# EAGLE design MegaSolardexEnergy (EAGLE 9.1.1)
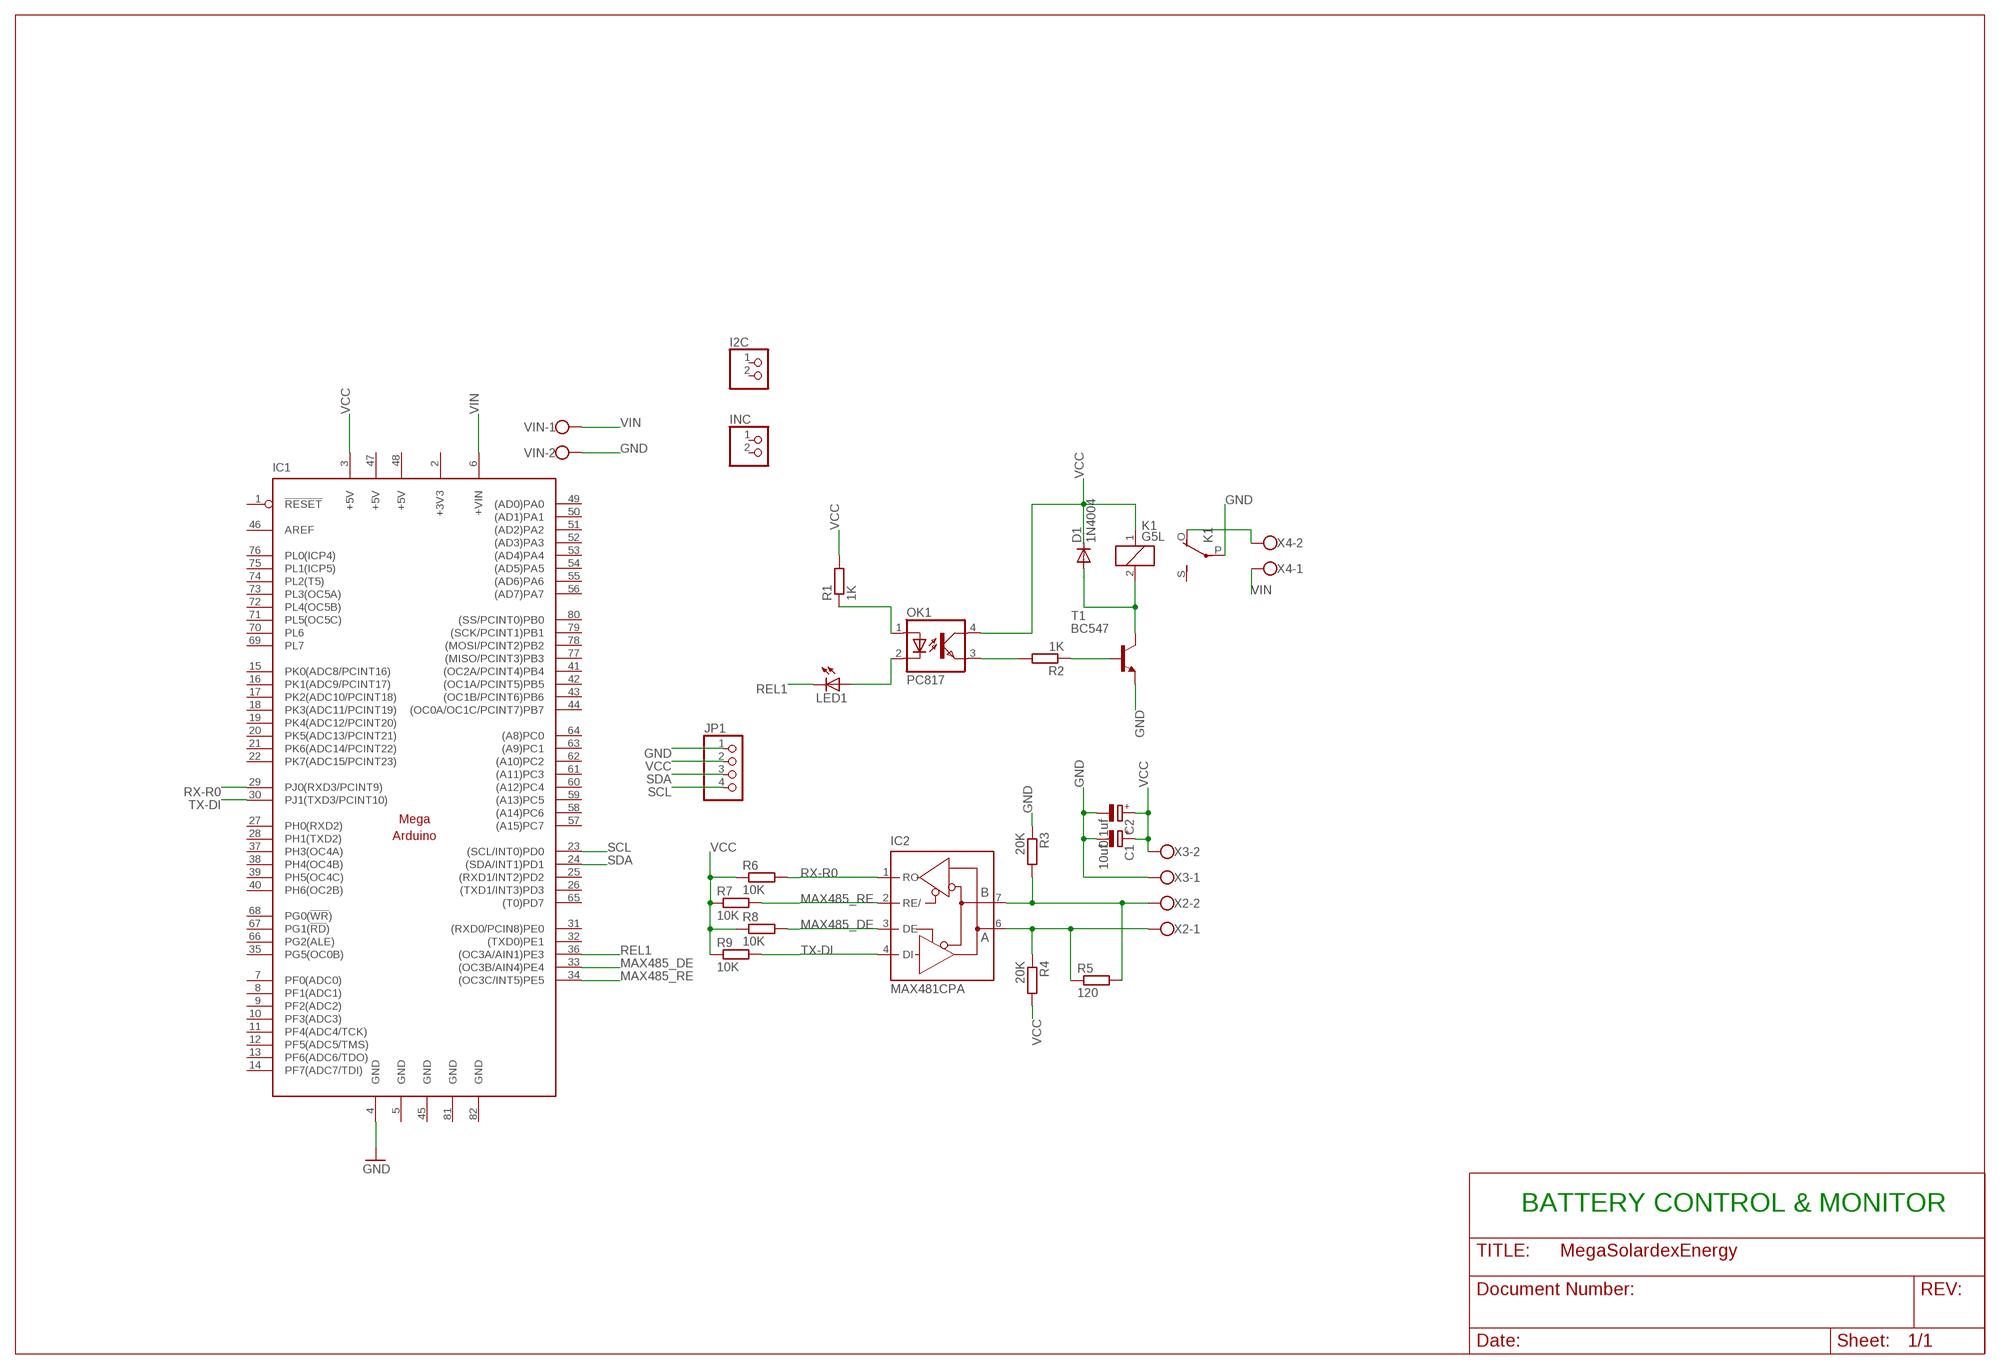
[diagram p0: schematic, sheet 1]

## Parts
C1  10uf  CPOL-EUE2,5-6E  [E2,5-6E]
C2  0,1uf  CPOL-EUE2,5-6E  [E2,5-6E]
D1  1N4004  [DO41-10]
I2C  PINHD-1X2  [1X02]
IC1  MEGAARDUINO_1  [MEGA_ARDUINO]
IC2  MAX481CPA  [DIL08]
INC  PINHD-1X2  [1X02]
JP1  PINHD-1X4  [1X04]
K1  G5L  [G5LE]
LED1  LED5MM  [LED5MM]
OK1  PC817  [DIL04]
R1  1K  R-EU_0204/7  [0204/7]
R2  1K  R-EU_0204/7  [0204/7]
R3  20K  R-EU_0204/7  [0204/7]
R4  20K  R-EU_0204/7  [0204/7]
R5  120  R-EU_0204/7  [0204/7]
R6  10K  R-EU_0204/7  [0204/7]
R7  10K  R-EU_0204/7  [0204/7]
R8  10K  R-EU_0204/7  [0204/7]
R9  10K  R-EU_0204/7  [0204/7]
T1  BC547  [TO92]
VIN  W237-102  [W237-102]
X2  W237-102  [W237-102]
X3  W237-102  [W237-102]
X4  W237-102  [W237-102]

## Nets
GND: C1.- C2.- IC1.4(GND) JP1.1 K1.P(2:P) R3.1 T1.1(E) VIN.2 X3.1
MAX485_DE: IC1.33((OC3B/AIN4)PE4) IC2.3(DE) R8.2
MAX485_RE: IC1.34((OC3C/INT5)PE5) IC2.2(RE/) R7.2
N$1: OK1.1(A) R1.1
N$2: LED1.A OK1.2(C)
N$3: OK1.3(EMIT) R2.2
N$4: R2.1 T1.2(B)
N$5: D1.A K1.2 T1.3(C)
N$6: K1.O(2:O) X4.2
N$9: IC2.7(B) R3.2 R5.2 X2.2
N$10: IC2.6(A) R4.1 R5.1 X2.1
REL1: IC1.36((OC3A/AIN1)PE3) LED1.K(C)
RX-R0: IC1.29(PJ0(RXD3/PCINT9)) IC2.1(RO) R6.2
SCL: IC1.23((SCL/INT0)PD0) JP1.4
SDA: IC1.24((SDA/INT1)PD1) JP1.3
TX-DI: IC1.30(PJ1(TXD3/PCINT10)) IC2.4(DI) R9.2
VCC: C1.+ C2.+ D1.C IC1.3(+5V) JP1.2 K1.1 OK1.4(COL) R1.2 R4.2 R6.1 R7.1 R8.1 R9.1 X3.2
VIN: IC1.6(+VIN) VIN.1 X4.1
Unconnected: I2C.1 I2C.2 IC1.1(!RESET) IC1.7(PF0(ADC0)) IC1.8(PF1(ADC1)) IC1.9(PF2(ADC2)) IC1.10(PF3(ADC3)) IC1.11(PF4(ADC4/TCK)) IC1.12(PF5(ADC5/TMS)) IC1.13(PF6(ADC6/TDO)) IC1.14(PF7(ADC7/TDI)) IC1.15(PK0(ADC8/PCINT16)) IC1.16(PK1(ADC9/PCINT17)) IC1.17(PK2(ADC10/PCINT18)) IC1.18(PK3(ADC11/PCINT19)) IC1.19(PK4(ADC12/PCINT20)) IC1.20(PK5(ADC13/PCINT21)) IC1.21(PK6(ADC14/PCINT22)) IC1.22(PK7(ADC15/PCINT23)) IC1.25((RXD1/INT2)PD2) IC1.26((TXD1/INT3)PD3) IC1.27(PH0(RXD2)) IC1.28(PH1(TXD2)) IC1.31((RXD0/PCIN8)PE0) IC1.32((TXD0)PE1) IC1.35(PG5(OC0B)) IC1.37(PH3(OC4A)) IC1.38(PH4(OC4B)) IC1.39(PH5(OC4C)) IC1.40(PH6(OC2B)) IC1.41((OC2A/PCINT4)PB4) IC1.42((OC1A/PCINT5)PB5) IC1.43((OC1B/PCINT6)PB6) IC1.44((OC0A/OC1C/PCINT7)PB7) IC1.46(AREF) IC1.49((AD0)PA0) IC1.50((AD1)PA1) IC1.51((AD2)PA2) IC1.52((AD3)PA3) IC1.53((AD4)PA4) IC1.54((AD5)PA5) IC1.55((AD6)PA6) IC1.56((AD7)PA7) IC1.57((A15)PC7) IC1.58((A14)PC6) IC1.59((A13)PC5) IC1.60((A12)PC4) IC1.61((A11)PC3) IC1.62((A10)PC2) IC1.63((A9)PC1) IC1.64((A8)PC0) IC1.65((T0)PD7) IC1.66(PG2(ALE)) IC1.67(PG1(!RD!)) IC1.68(PG0(!WR!)) IC1.69(PL7) IC1.70(PL6) IC1.71(PL5(OC5C)) IC1.72(PL4(OC5B)) IC1.73(PL3(OC5A)) IC1.74(PL2(T5)) IC1.75(PL1(ICP5)) IC1.76(PL0(ICP4)) IC1.77((MISO/PCINT3)PB3) IC1.78((MOSI/PCINT2)PB2) IC1.79((SCK/PCINT1)PB1) IC1.80((SS/PCINT0)PB0) INC.1 INC.2 K1.S(2:S)

## Notes on the sheet
- BATTERY CONTROL & MONITOR

## Power pins joined to a net without a drawn wire
+3V3: IC1.2(+3V3)
+5V: IC1.47(+5V) IC1.48(+5V)
GND: IC1.5(GND) IC1.45(GND) IC1.81(GND) IC1.82(GND) IC2.5(GND)
VCC: IC2.8(VCC)

## Library data of the parts
C1 C2 = rcl:CPOL-EU: POLARIZED CAPACITOR, European symbol; SPICEPREFIX: C
D1 = diode:1N4004: DIODE general purpose rectifier, 1 A
I2C INC = pinhead:PINHD-1X2: PIN HEADER
IC1 = arduino:MEGAARDUINO_1: The Arduino Mega is a microcontroller board based on the ATmega1280. - 54 digital input/output pins (of which 14 can be used as PWM outputs) - 16 analog inputs - 4 UARTs (hardware serial ports) - 16 MHz crystal oscillator - USB connection - power jack - ICSP header - reset button It contains everything needed to support the microcontroller; simply connect it to a computer with a USB cable or power it with a AC-to-DC adapter or battery to get started. The Mega is compatible with most shields designed for the Arduino Duemilanove or Diecimila. http://arduino.cc/en/Main/ArduinoBoardMega
IC2 = maxim:MAX481CPA: RS485 TRANSEIVER; MPN: MAX481CPA+; OC_FARNELL: unknown; OC_NEWARK: 99K3445
JP1 = pinhead:PINHD-1X4: PIN HEADER
K1 = relay:G5L: RELAY 1 x switch, 10 A/120 V AC, 8 A/30 V ADC, Omron; OC_FARNELL: unknown; OC_NEWARK: unknown
LED1 = led:LED: LED OSRAM: - CHIPLED LG R971, LG N971, LY N971, LG Q971, LY Q971, LO R971, LY R971 LH N974, LH R974 LS Q976, LO Q976, LY Q976 LO Q996 - Hyper CHIPLED LW Q18S LB Q993, LB Q99A, LB R99A - SideLED LS A670, LO A670, LY A670, LG A670, LP A670 LB A673, LV A673, LT A673, LW A673 LH A674 LY A675 LS A676, LA A676, LO A676, LY A676, LW A676 LS A679, LY A679, LG A679 - Hyper Micro SIDELED® LS Y876, LA Y876, LO Y876, LY Y876 LT Y87S - SmartLED LW L88C, LW L88S LB L89C, LB L89S, LG L890 LS L89K, LO L89K, LY L89K LS L896, LA L896, LO L896, LY L896 - TOPLED LS T670, LO T670, LY T670, LG T670, LP T670 LSG T670, LSP T670, LSY T670, LOP T670, LYG T670 LG T671, LOG T671, LSG T671 LB T673, LV T673, LT T673, LW T673 LH T674 LS T676, LA T676, LO T676, LY T676, LB T676, LH T676, LSB T676, LW T676 LB T67C, LV T67C, LT T67C, LS T67K, LO T67K, LY T67K, LW E67C LS E67B, LA E67B, LO E67B, LY E67B, LB E67C, LV E67C, LT E67C LW T67C LS T679, LY T679, LG T679 LS T770, LO T770, LY T770, LG T770, LP T770 LB T773, LV T773, LT T773, LW T773 LH T774 LS E675, LA E675, LY E675, LS T675 LS T776, LA T776, LO T776, LY T776, LB T776 LHGB T686 LT T68C, LB T68C - Hyper Mini TOPLED® LB M676 - Mini TOPLED Santana® LG M470 LS M47K, LO M47K, LY M47K Source: http://www.osram.convergy.de LUXEON: - LUMILED® LXK2-PW12-R00, LXK2-PW12-S00, LXK2-PW14-U00, LXK2-PW14-V00 LXK2-PM12-R00, LXK2-PM12-S00, LXK2-PM14-U00 LXK2-PE12-Q00, LXK2-PE12-R00, LXK2-PE12-S00, LXK2-PE14-T00, LXK2-PE14-U00 LXK2-PB12-K00, LXK2-PB12-L00, LXK2-PB12-M00, LXK2-PB14-N00, LXK2-PB14-P00, LXK2-PB14-Q00 LXK2-PR12-L00, LXK2-PR12-M00, LXK2-PR14-Q00, LXK2-PR14-R00 LXK2-PD12-Q00, LXK2-PD12-R00, LXK2-PD12-S00 LXK2-PH12-R00, LXK2-PH12-S00 LXK2-PL12-P00, LXK2-PL12-Q00, LXK2-PL12-R00 Source: www.luxeon.com KINGBRIGHT: KA-3528ASYC Source: www.kingbright.com
OK1 = optocoupler:PC817: SHARP OPTO COUPLER; MPN: PC817X4J000F; OC_FARNELL: 9707727; OC_NEWARK: 97K7059
R1-R9 = rcl:R-EU_: RESISTOR, European symbol; SPICEPREFIX: R
T1 = transistor-neu-to92:BC547: NPN TRANSISTOR
VIN X2-X4 = con-wago-500:W237-102: WAGO SCREW CLAMP; MPN: 237-102; OC_FARNELL: unknown; OC_NEWARK: 70K9898

## Board
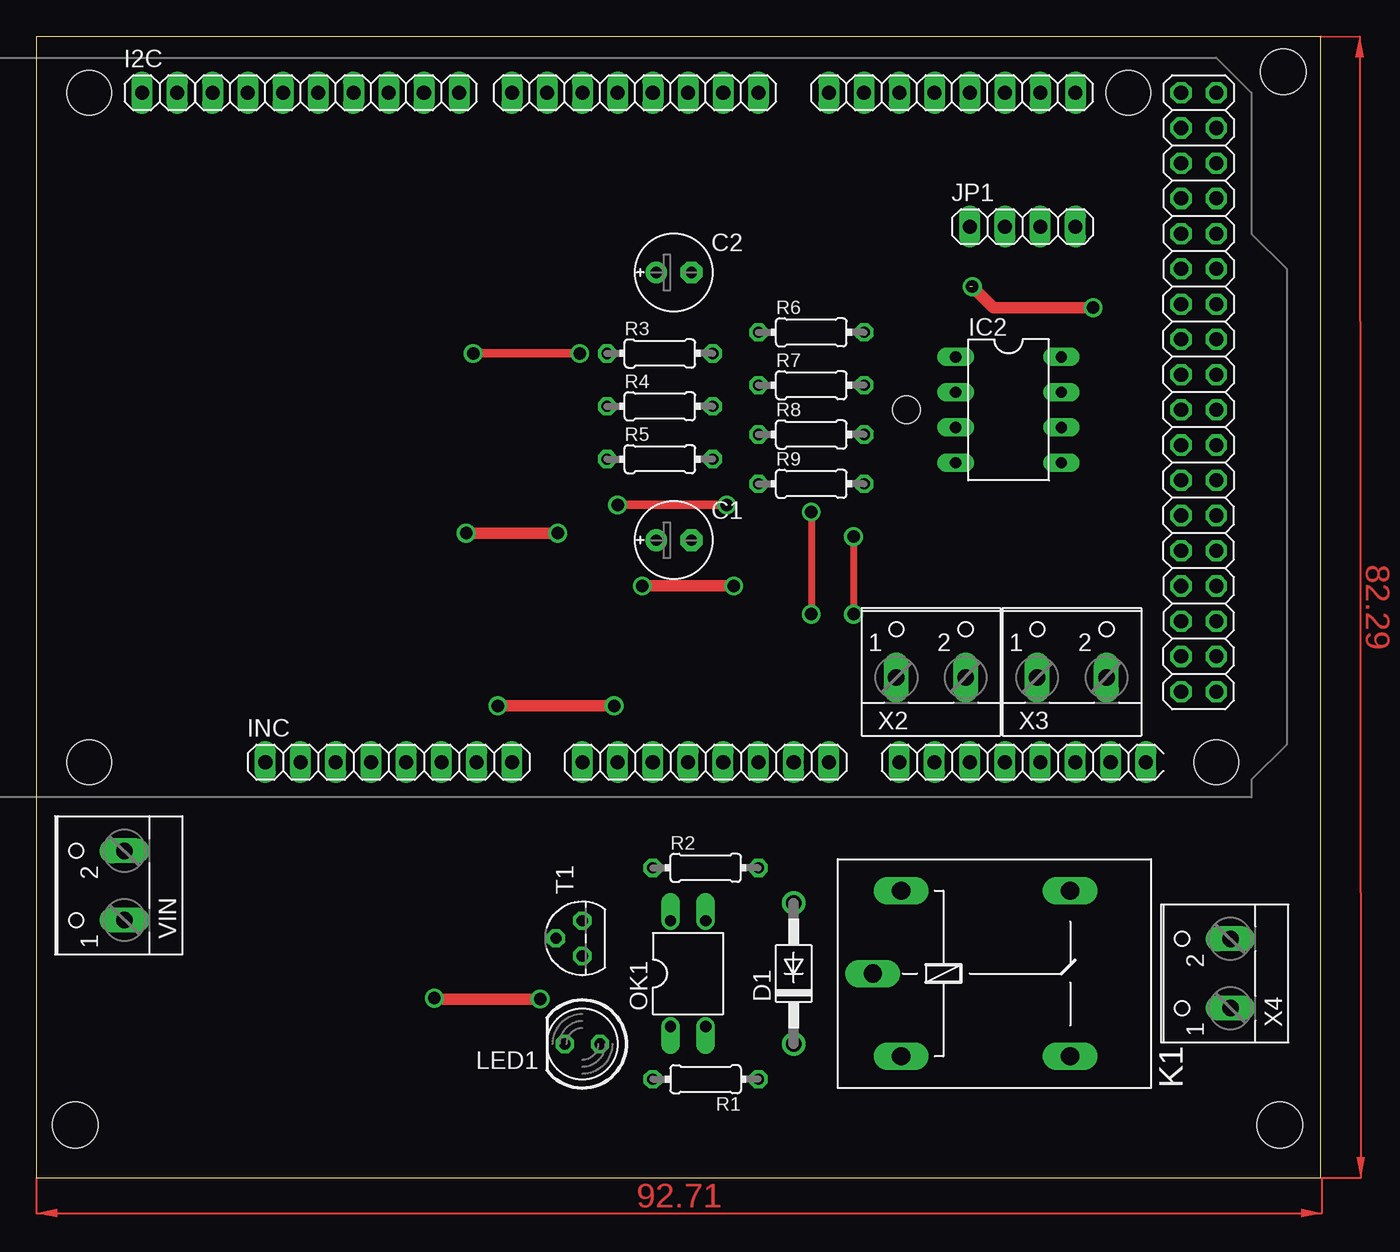
[diagram p1: board, top side]
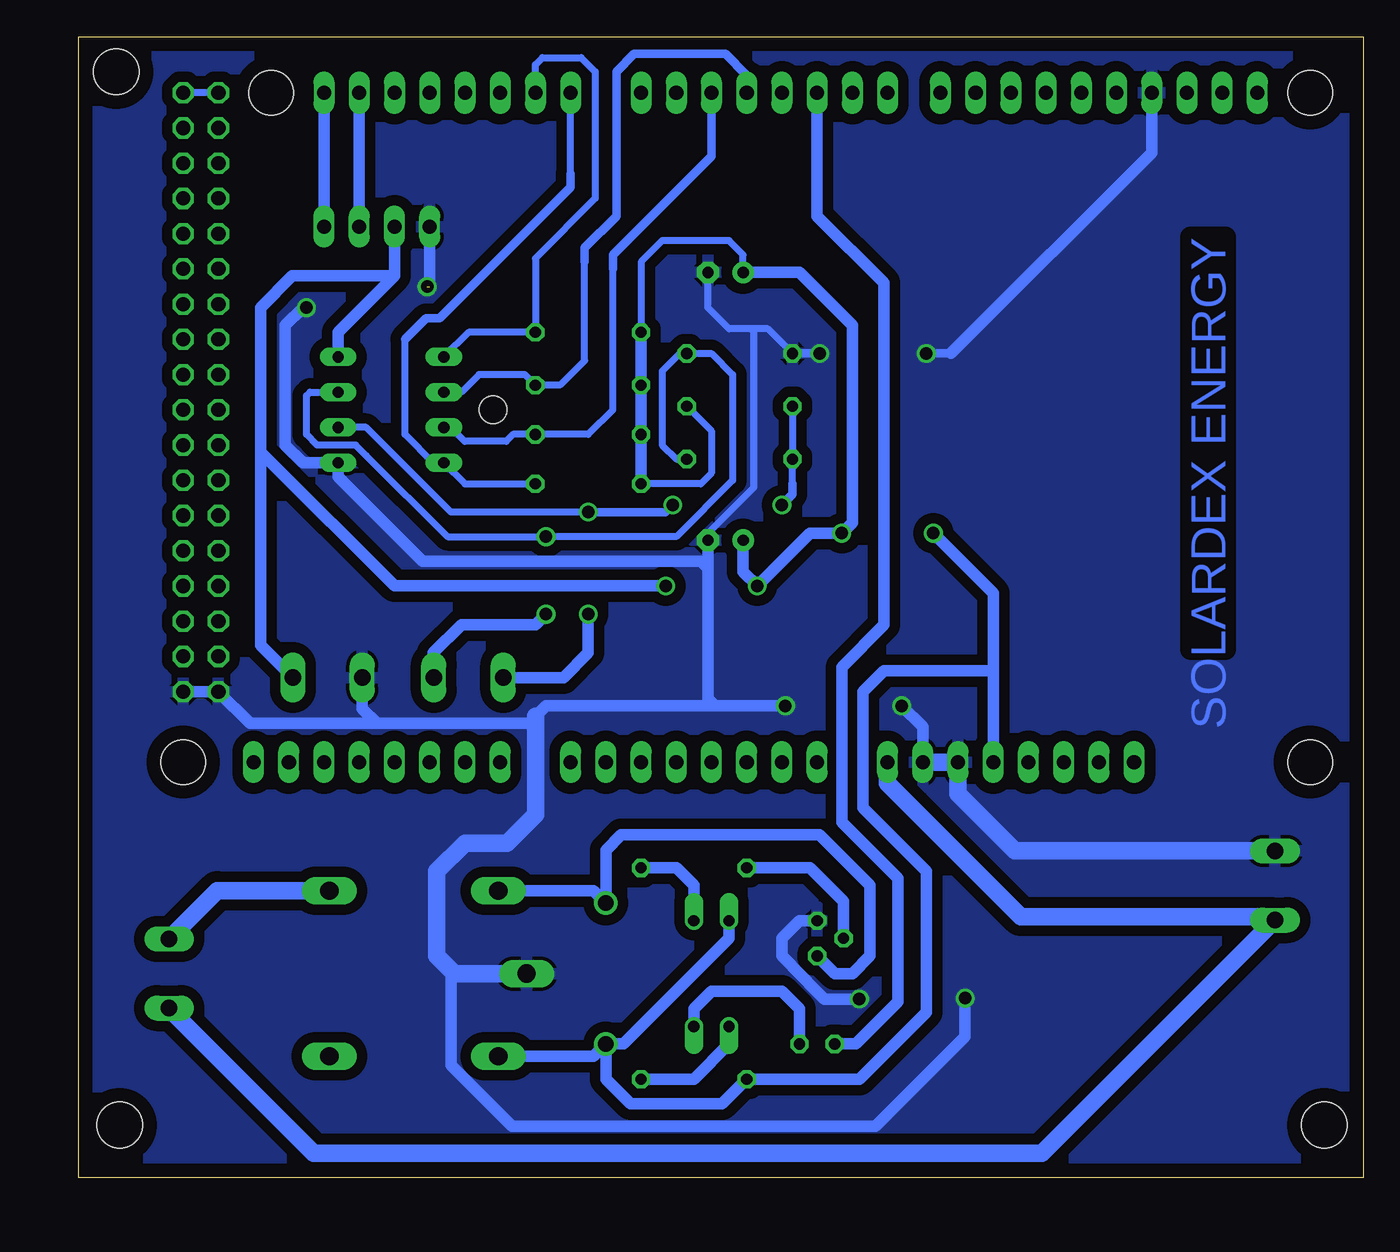
[diagram p2: board, bottom side, seen from below]

Size 92.63 x 82.29 mm. Coordinates in mm from the lower left corner, seen from the top.
Outline: 0,0 92.63,0 92.63,82.29 0,82.29 0,0
Copper layers (1*16): Top 0.035mm / dielectric 1.5mm / Bottom 0.035mm
Design rules "default *": minimum track width 6mil, minimum drill 0.35mm, track to track 30mil, track to pad 30mil, pad to pad 30mil, via to via 30mil, smd to smd 30mil, copper to edge 40mil, drill to drill 6mil, minimum pad ring 10mil, minimum via ring 8mil, stop-mask expansion 4mil, vias tented up to drill 0mil, thermal gap 10mil
Holes 3.3 mm at 89.92,79.76 89.66,3.81 2.79,3.81

### Footprints (pad centres in the part's own frame; a part is rotated, then mirrored left to right if it is on the bottom)
E2,5-6E = drill 0.813 pad 1.575: + -1.27,0 | drill 0.813 pad 1.575 octagon: - 1.27,0
DO41-10 = drill 1.118: A 5.08,0; C -5.08,0
1X02 = drill 1.016 long: 1 -1.27,0; 2 1.27,0
MEGA_ARDUINO = drill 1.016 long: 1 33.02,2.54; 2 35.56,2.54; 3 38.1,2.54; 4 40.64,2.54; 5 43.18,2.54; 6 45.72,2.54; 7 50.8,2.54; 8 53.34,2.54; 9 55.88,2.54; 10 58.42,2.54; 11 60.96,2.54; 12 63.5,2.54; 13 66.04,2.54; 14 68.58,2.54; 15 73.66,2.54; 16 76.2,2.54; 17 78.74,2.54; 18 81.28,2.54; 19 83.82,2.54; 20 86.36,2.54; 21 88.9,2.54; 22 91.44,2.54; 23 86.36,50.8; 24 83.82,50.8; 25 81.28,50.8; 26 78.74,50.8; 27 76.2,50.8; 28 73.66,50.8; 29 71.12,50.8; 30 68.58,50.8; 31 63.5,50.8; 32 60.96,50.8; 33 58.42,50.8; 34 55.88,50.8; 35 53.34,50.8; 36 50.8,50.8; 37 48.26,50.8; 38 45.72,50.8; 39 41.91,50.8; 40 39.37,50.8; 41 36.83,50.8; 42 34.29,50.8; 43 31.75,50.8; 44 29.21,50.8; 45 26.67,50.8; 46 24.13,50.8 | drill 1.016 octagon: 47 93.98,50.8; 48 96.52,50.8; 49 93.98,48.26; 50 96.52,48.26; 51 93.98,45.72; 52 96.52,45.72; 53 93.98,43.18; 54 96.52,43.18; 55 93.98,40.64; 56 96.52,40.64; 57 93.98,38.1; 58 96.52,38.1; 59 93.98,35.56; 60 96.52,35.56; 61 93.98,33.02; 62 96.52,33.02; 63 93.98,30.48; 64 96.52,30.48; 65 93.98,27.94; 66 96.52,27.94; 67 93.98,25.4; 68 96.52,25.4; 69 93.98,22.86; 70 96.52,22.86; 71 93.98,20.32; 72 96.52,20.32; 73 93.98,17.78; 74 96.52,17.78; 75 93.98,15.24; 76 96.52,15.24; 77 93.98,12.7; 78 96.52,12.7; 79 93.98,10.16; 80 96.52,10.16; 81 93.98,7.62; 82 96.52,7.62 | hole 3.2: 15.24,50.8; 15.24,2.54; 90.17,50.8; 96.52,2.54 | hole 2: 74.168,27.94
DIL08 = drill 0.813 long: 1 -3.81,-3.81; 2 -1.27,-3.81; 3 1.27,-3.81; 4 3.81,-3.81; 5 3.81,3.81; 6 1.27,3.81; 7 -1.27,3.81; 8 -3.81,3.81
1X04 = drill 1.016 long: 1 -3.81,0; 2 -1.27,0; 3 1.27,0; 4 3.81,0
G5LE = drill 1.321 long: 1 -7.493,-5.969; 2 -7.493,5.969; O 4.699,5.969; P -9.525,0; S 4.699,-5.969
LED5MM = drill 0.813 octagon: A -1.27,0; K 1.27,0
DIL04 = drill 0.813 offset: 1 -1.27,-3.81; 2 1.27,-3.81; 3 1.27,3.81; 4 -1.27,3.81
0204/7 = drill 0.813 octagon: 1 -3.81,0; 2 3.81,0
TO92 = drill 0.813 octagon: 1 1.27,0; 2 0,1.905; 3 -1.27,0
W237-102 = drill 1.194 long: 1 -2.5,-1.27; 2 2.5,-1.27

### Placement (x,y rotation side)
C1  45.97,45.97 0 top
C2  45.97,65.28 0 top
D1  54.61,14.73 90 top
I2C  8.89,78.23 0 top
IC1  -11.43,27.43 0 top
IC2  70.1,55.37 270 top
INC  17.78,29.97 0 top
JP1  71.12,68.58 0 top
K1  69.85,14.73 0 top
LED1  39.37,9.65 180 top
OK1  46.99,14.73 0 top
R1  48.26,7.11 180 top
R2  48.26,22.35 0 top
R3  44.96,59.44 0 top
R4  44.96,55.63 0 top
R5  44.96,51.82 0 top
R6  55.88,60.96 0 top
R7  55.88,57.15 0 top
R8  55.88,53.59 0 top
R9  55.88,50.04 0 top
T1  39.37,17.27 90 top
VIN  5.08,21.08 90 top
X2  64.52,37.34 0 top
X3  74.68,37.34 0 top
X4  84.84,14.73 90 top

### Tracks (layer width: path | path; a pad name or v marks a point on that pad's centre or on a via)
+5V
  Bottom 0.508: IC1.47 IC1.48
GND  (via drill 0.35, 0.9)  (1 unrouted)
  Top 0.61: v39.18,59.44 v31.5,59.44
  Top 0.813: v41.66,34.04 v33.27,34.04 | v76.2,62.74 69.01,62.74 v67.5,64.25 | v36.32,12.89 28.77,12.89 v28.7,12.95
  Bottom 0.508: R3.1 42.93,61.21 43.94,61.21 | C2.- 47.24,62.74 45.72,61.21 44.2,61.21 43.94,61.21 | 43.94,61.21 43.94,49.78 47.24,46.48 C1.-
  Bottom 0.61: R3.1 v39.18,59.44 | v31.5,59.44 29.72,59.44
  Bottom 0.813: T1.1 40.64,18.54 41.91,17.27 41.91,16 41.2,15.29 41.2,15.24 38.84,12.89 v36.32,12.89 | C1.- 47.24,43.94 | 47.24,43.94 47.24,34.54 46.74,34.04 | 47.24,43.94 47.75,44.45 67.82,44.45 73.91,50.55 IC2.5 76.45,51.56 77.72,52.83 77.72,61.47 | JP1.1 v67.31,64.26 | 59.69,32.77 71.12,32.77 | X3.1 72.18,33.82 71.12,32.77 | 71.12,32.77 80.26,32.77 IC1.81 IC1.82 | 29.72,59.44 15.24,73.91 IC1.45 | 65.53,14.73 65.79,14.48 65.79,8.13 61.37,3.71 35.15,3.71 28.7,10.16 v28.7,12.95 | 59.69,33.27 58.93,34.04 46.74,34.04 | 46.74,34.04 v41.66,34.04 | v33.27,34.04 31.75,32.51 IC1.5 | 77.72,61.47 | 77.72,61.47 76.45,62.74 v76.2,62.74
  Bottom 1.27: VIN.2 25.11,23.58 29.21,27.69 IC1.4 IC1.5 | K1.P 65.53,14.73 66.8,16 66.8,22.1 64.77,24.13 61.72,24.13 59.69,26.16 59.69,32.26 59.69,32.77 59.69,33.27
  pour Bottom: 0,82.3 0,0.25 0,-0.51 92.96,-0.51 92.96,82.8 0,82.8 0,82.55
MAX485_DE
  Bottom 0.508: IC2.3 65.79,54.1 64.79,53.1 61.8,53.1 61.31,53.59 R8.2 55.88,53.59 54.1,55.37 54.1,65.53
  Bottom 0.61: 54.1,65.53 54.1,66.55 46.99,73.66 IC1.33
MAX485_RE
  Bottom 0.508: IC2.2 65.02,56.64 63.75,57.91 60.45,57.91 R7.2 57.91,57.15 56.13,58.93 56.13,66.04
  Bottom 0.61: 56.13,66.04 56.13,67.06 53.85,69.34 53.85,79.76 52.58,81.03 45.97,81.03 44.45,79.5 IC1.34
N$1
  Bottom 0.813: R1.1 48.26,7.11 45.72,9.65 OK1.1
N$2
  Bottom 0.813: OK1.2 48.26,12.19 46.99,13.46 41.91,13.46 40.64,12.19 LED1.A
N$3
  Bottom 0.813: R2.2 49.53,22.35 48.26,21.08 OK1.3
N$4
  Bottom 0.813: R2.1 39.88,22.35 37.47,19.94 T1.2
N$5
  Bottom 0.813: K1.2 55.5,20.7 D1.A 54.61,23.62 53.5,24.73 39.21,24.73 35.56,21.08 35.56,16 36.83,14.73 38.1,14.73 T1.3
N$6
  Bottom 1.27: X4.2 82.64,20.7 K1.O
N$9  (via drill 0.35, 0.9)
  Top 0.508: v58.93,46.23 v58.93,40.64
  Bottom 0.508: IC2.7 75.95,56.64 76.2,56.39 76.2,53.59 75.44,52.83 72.64,52.83 71.88,52.07 66.04,46.23 59.44,46.23 v58.93,46.23 49.53,46.23 45.47,50.29 45.47,57.91 46.99,59.44 R3.2 49.28,59.44 50.55,58.17 50.55,52.83 49.53,51.82 R5.2 | 67.06,37.85 67.02,37.81
  Bottom 0.813: v58.93,40.64 59.69,39.88 65.02,39.88 67.06,37.85 | 67.02,37.81 X2.2
N$10  (via drill 0.35, 0.9)
  Top 0.508: v55.88,48.01 v55.88,40.64
  Top 0.61: v49.78,48.51 v41.91,48.51
  Bottom 0.508: R4.1 R5.1 41.15,50.04 | IC2.6 71.88,54.1 69.85,52.07 65.79,48.01 v55.88,48.01
  Bottom 0.61: v55.88,48.01 50.29,48.01 v49.78,48.51 | 41.15,50.04 41.15,49.28 v41.91,48.51
  Bottom 0.813: X2.1 57.66,36.07 55.88,37.85 v55.88,40.64
REL1
  Bottom 0.813: IC1.36 39.37,69.34 34.54,64.52 34.54,39.88 37.59,36.83 37.59,25.65 37.08,25.15 33.53,21.59 33.53,12.7 36.58,9.65 LED1.K
RX-R0
  Bottom 0.508: IC2.1 64.52,60.96 R6.2 59.69,66.29 55.37,70.61 55.37,79.76 56.39,80.77 59.18,80.77 59.69,80.26 IC1.29
SCL
  Bottom 0.813: JP1.4 IC1.23
SDA
  Bottom 0.813: JP1.3 IC1.24
TX-DI
  Bottom 0.508: R9.2 64.77,50.04 IC2.4 67.06,51.56 69.09,53.59 69.09,60.45 | 57.15,72.39 IC1.30
  Bottom 0.61: 69.09,60.45 67.56,61.98 66.59,61.98 57.15,71.42 57.15,72.39
VCC  (via drill 0.9)
  Top 0.813: v50.29,42.67 v43.69,42.67 | v37.59,46.48 v30.99,46.48
  Bottom 0.508: C2.+ 44.7,66.55 45.72,67.56 50.55,67.56 52.07,66.04 R6.1 | R4.2 46.99,53.85 46.99,50.8 47.75,50.04 R9.1
  Bottom 0.813: K1.1 55.5,8.76 D1.C | D1.C 54.61,7.11 52.83,5.33 46.23,5.33 R1.2 36.32,7.11 31.5,11.94 31.5,22.1 36.07,26.67 36.07,35.05 34.54,36.58 26.67,36.58 | OK1.4 45.72,17.27 46.99,16 53.34,9.65 D1.C | IC1.3 26.67,34.8 26.67,35.31 26.67,35.81 26.67,36.58 | R6.1 R7.1 R8.1 R9.1 | v30.99,46.48 26.67,42.16 26.67,36.58 | C2.+ 40.64,65.28 36.83,61.47 36.83,47.24 v37.59,46.48 39.88,46.48 v43.69,42.67 44.7,43.69 C1.+ | JP1.2 69.85,65.02 | IC2.8 73.91,60.96 69.85,65.02 | 69.85,65.02 77.22,65.02 79.5,62.74 79.5,52.32 | 79.5,52.32 78.99,51.82 69.85,42.67 v50.29,42.67 | 79.5,52.32 79.5,38.39 X3.2
VIN
  Bottom 1.27: IC1.6 34.29,28.45 24.68,18.84 6.6,18.84 VIN.1 23.15,1.78 75.69,1.78 86.11,12.19 X4.1
(copper drawn outside any net)
  shapes: Top area x2

### Text on the board
Bottom: SOLARDEX ENERGY